# EAGLE schematic base_shield (EAGLE 8.7.0)
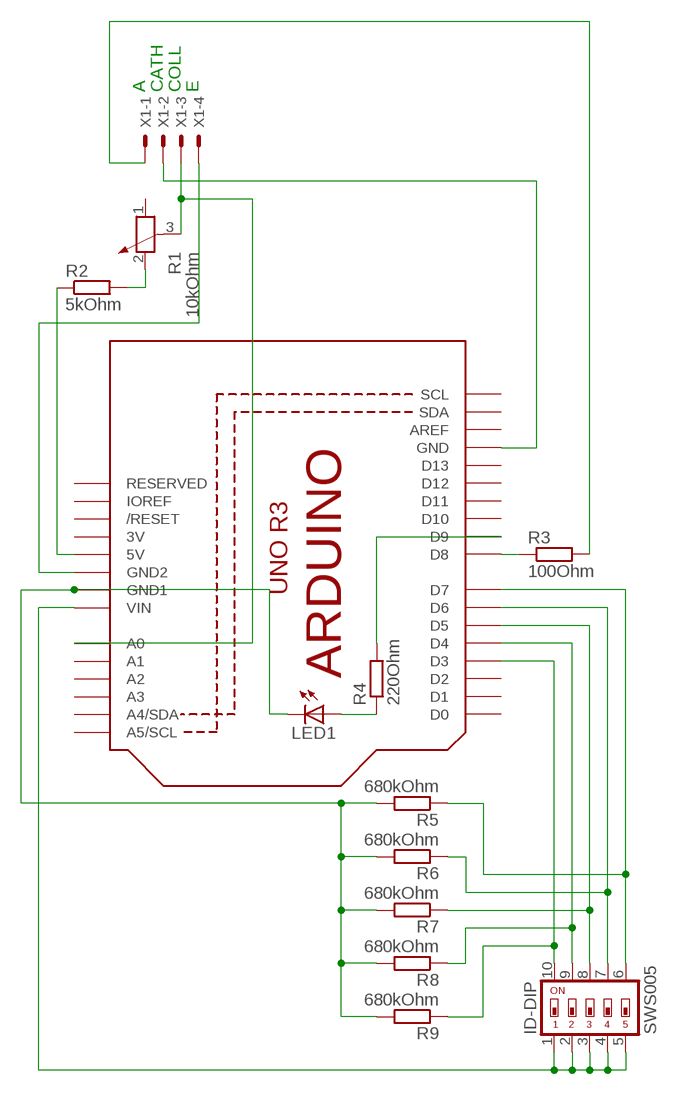
[diagram p0: schematic, sheet 1]

## Parts
ID-DIP  SWS005  [SMS-005]
LED1  LED3MM  [LED3MM]
R1  10kOhm  POTENTIOMETER_PT-10  [PT-10]
R2  5kOhm  R-EU_0204/5  [0204/5]
R3  100Ohm  R-EU_0204/5  [0204/5]
R4  220Ohm  R-EU_0204/5  [0204/5]
R5  680kOhm  R-EU_0204/5  [0204/5]
R6  680kOhm  R-EU_0204/5  [0204/5]
R7  680kOhm  R-EU_0204/5  [0204/5]
R8  680kOhm  R-EU_0204/5  [0204/5]
R9  680kOhm  R-EU_0204/5  [0204/5]
U1  ARDUINOR3-DIMENSION  [ARDUINOR3]
X1  KK-156-4  [KK-156-4]

## Nets
N$1: R1.3 U1.A0 X1.3
N$2: R1.2 R2.2
N$4: R3.1 U1.D8
N$5: R3.2 X1.1
N$6: LED1.A R4.1
N$7: LED1.K(C) R5.2 R6.2 R7.2 R8.2 R9.2 U1.GND1
N$8: R4.2 U1.D9
N$9: R2.1 U1.5V
N$10: ID-DIP.1 ID-DIP.2 ID-DIP.3 ID-DIP.4 ID-DIP.5 U1.VIN
N$11: ID-DIP.10 R9.1 U1.D3
N$12: ID-DIP.9 R8.1 U1.D4
N$13: U1.GND2 X1.4
N$14: ID-DIP.7 R6.1 U1.D6
N$15: ID-DIP.6 R5.1 U1.D7
N$16: U1.GND X1.2
N$19: ID-DIP.8 R7.1 U1.D5
Unconnected: R1.1 U1.A1 U1.A2 U1.A3 U1.A4(A4/SDA) U1.A5(A5/SCL) U1.AREF U1.D0 U1.D1 U1.D2 U1.D10 U1.D11 U1.D12 U1.D13 U1.IOREF U1.RESERVED U1.RESET(/RESET) U1.SCL U1.SDA

## Notes on the sheet
- A | CATH | COLL | E

## Power pins joined to a net without a drawn wire
3V: U1.3V

## Library data of the parts
ID-DIP = smd-special:SWS005: SMD Dip Switch 5 pol.
LED1 = led:LED: LED OSRAM: - CHIPLED LG R971, LG N971, LY N971, LG Q971, LY Q971, LO R971, LY R971 LH N974, LH R974 LS Q976, LO Q976, LY Q976 LO Q996 - Hyper CHIPLED LW Q18S LB Q993, LB Q99A, LB R99A - SideLED LS A670, LO A670, LY A670, LG A670, LP A670 LB A673, LV A673, LT A673, LW A673 LH A674 LY A675 LS A676, LA A676, LO A676, LY A676, LW A676 LS A679, LY A679, LG A679 - Hyper Micro SIDELED® LS Y876, LA Y876, LO Y876, LY Y876 LT Y87S - SmartLED LW L88C, LW L88S LB L89C, LB L89S, LG L890 LS L89K, LO L89K, LY L89K LS L896, LA L896, LO L896, LY L896 - TOPLED LS T670, LO T670, LY T670, LG T670, LP T670 LSG T670, LSP T670, LSY T670, LOP T670, LYG T670 LG T671, LOG T671, LSG T671 LB T673, LV T673, LT T673, LW T673 LH T674 LS T676, LA T676, LO T676, LY T676, LB T676, LH T676, LSB T676, LW T676 LB T67C, LV T67C, LT T67C, LS T67K, LO T67K, LY T67K, LW E67C LS E67B, LA E67B, LO E67B, LY E67B, LB E67C, LV E67C, LT E67C LW T67C LS T679, LY T679, LG T679 LS T770, LO T770, LY T770, LG T770, LP T770 LB T773, LV T773, LT T773, LW T773 LH T774 LS E675, LA E675, LY E675, LS T675 LS T776, LA T776, LO T776, LY T776, LB T776 LHGB T686 LT T68C, LB T68C - Hyper Mini TOPLED® LB M676 - Mini TOPLED Santana® LG M470 LS M47K, LO M47K, LY M47K Source: http://www.osram.convergy.de LUXEON: - LUMILED® LXK2-PW12-R00, LXK2-PW12-S00, LXK2-PW14-U00, LXK2-PW14-V00 LXK2-PM12-R00, LXK2-PM12-S00, LXK2-PM14-U00 LXK2-PE12-Q00, LXK2-PE12-R00, LXK2-PE12-S00, LXK2-PE14-T00, LXK2-PE14-U00 LXK2-PB12-K00, LXK2-PB12-L00, LXK2-PB12-M00, LXK2-PB14-N00, LXK2-PB14-P00, LXK2-PB14-Q00 LXK2-PR12-L00, LXK2-PR12-M00, LXK2-PR14-Q00, LXK2-PR14-R00 LXK2-PD12-Q00, LXK2-PD12-R00, LXK2-PD12-S00 LXK2-PH12-R00, LXK2-PH12-S00 LXK2-PL12-P00, LXK2-PL12-Q00, LXK2-PL12-R00 Source: www.luxeon.com KINGBRIGHT: KA-3528ASYC Source: www.kingbright.com
R1 = rcl:POTENTIOMETER_: Potentiometer; SPICEMODEL: POT; SPICEPREFIX: X
R2-R4 = rcl:R-EU_: RESISTOR, European symbol; SPICEPREFIX: R
R5-R9 = resistor:R-EU_: RESISTOR, European symbol
U1 = adafruit:ARDUINOR3: This is a new object for the new Arduino R3 - with extra pins that you may want to use (such as IOref, and duplicated A4/A5
X1 = con-molex:KK-156-4: KK 156 HEADER Source: http://www.molex.com/pdm_docs/sd/026604100_sd.pdf; MF: MOLEX; OC_FARNELL: unknown; OC_NEWARK: unknown